# Altium project RiscPC_VRAM_16bit.PrjPcb
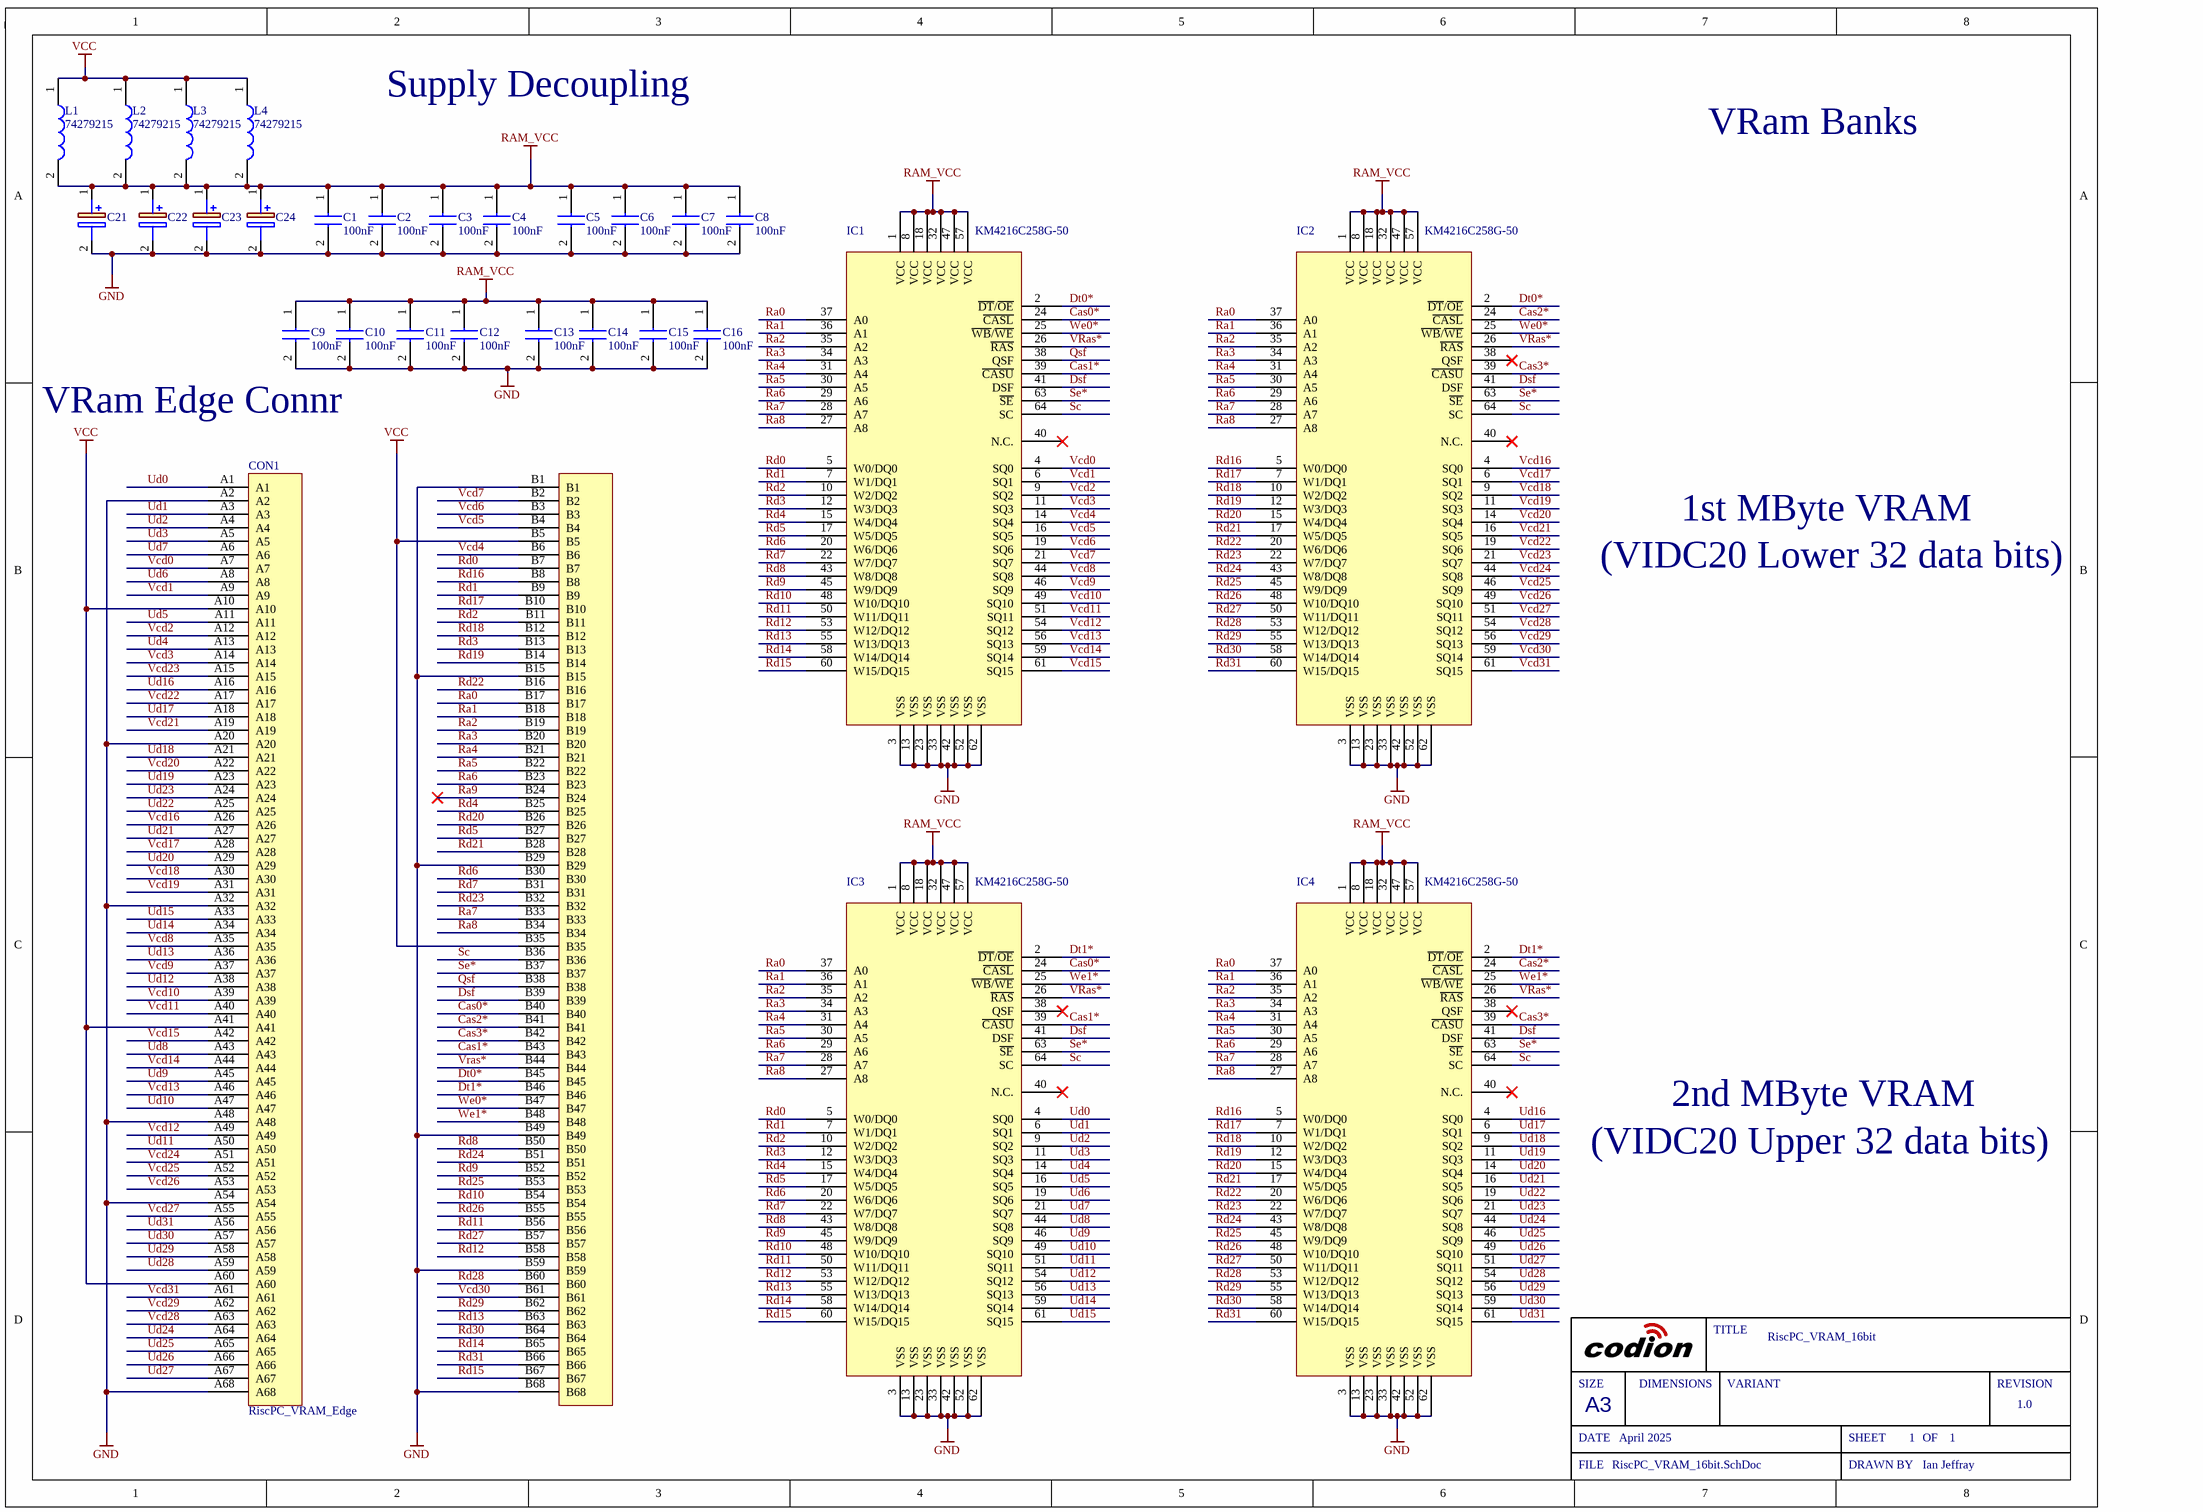
[diagram p0: RiscPC_VRAM_16bit.SchDoc]
Sch_RevNo: 1.0; Sch_ReleaseDate: April 2025; Project_Title: RiscPC_VRAM_16bit; DrawnBy: Ian Jeffray
1 sheet, 29 parts. Net scope: global (net labels, ports and power ports of the same name join across sheets).
Board file: RiscPC_VRAM_16bit.PcbDoc

## Sheet RiscPC_VRAM_16bit.SchDoc
size A3; SheetNumber: 1; SheetTotal: 1

### Parts
C1  100nF  [CAPC2012X145N]
C2  100nF  [CAPC2012X145N]
C3  100nF  [CAPC2012X145N]
C4  100nF  [CAPC2012X145N]
C5  100nF  [CAPC2012X145N]
C6  100nF  [CAPC2012X145N]
C7  100nF  [CAPC2012X145N]
C8  100nF  [CAPC2012X145N]
C9  100nF  [CAPC2012X145N]
C10  100nF  [CAPC2012X145N]
C11  100nF  [CAPC2012X145N]
C12  100nF  [CAPC2012X145N]
C13  100nF  [CAPC2012X145N]
C14  100nF  [CAPC2012X145N]
C15  100nF  [CAPC2012X145N]
C16  100nF  [CAPC2012X145N]
C21  EEE-HA1C470AP  [EEE1AA101SP]  (value not drawn)
C22  EEE-HA1C470AP  [EEE1AA101SP]  (value not drawn)
C23  EEE-HA1C470AP  [EEE1AA101SP]  (value not drawn)
C24  EEE-HA1C470AP  [EEE1AA101SP]  (value not drawn)
CON1  RiscPC_VRAM_Edge  [RiscPC_VRAM_Edge]
IC1  KM4216C258G-50  [KM4216C258G-50_SSOP64]
IC2  KM4216C258G-50  [KM4216C258G-50_SSOP64]
IC3  KM4216C258G-50  [KM4216C258G-50_SSOP64]
IC4  KM4216C258G-50  [KM4216C258G-50_SSOP64]
L1  74279215  [INDC3216X130N]
L2  74279215  [INDC3216X130N]
L3  74279215  [INDC3216X130N]
L4  74279215  [INDC3216X130N]

### Nets
GND: C1.2 C2.2 C3.2 C4.2 C5.2 C6.2 C7.2 C8.2 C9.2 C10.2 C11.2 C12.2 C13.2 C14.2 C15.2 C16.2 C21.2(-) C22.2(-) C23.2(-) C24.2(-) CON1.A2 CON1.A20 CON1.A32 CON1.A48 CON1.A54 CON1.A68 CON1.B1 CON1.B15 CON1.B29 CON1.B49 CON1.B59 CON1.B68 IC1.3(VSS) IC1.13(VSS) IC1.23(VSS) IC1.33(VSS) IC1.42(VSS) IC1.52(VSS) IC1.62(VSS) IC2.3(VSS) IC2.13(VSS) IC2.23(VSS) IC2.33(VSS) IC2.42(VSS) IC2.52(VSS) IC2.62(VSS) IC3.3(VSS) IC3.13(VSS) IC3.23(VSS) IC3.33(VSS) IC3.42(VSS) IC3.52(VSS) IC3.62(VSS) IC4.3(VSS) IC4.13(VSS) IC4.23(VSS) IC4.33(VSS) IC4.42(VSS) IC4.52(VSS) IC4.62(VSS)
RAM_VCC: C1.1 C2.1 C3.1 C4.1 C5.1 C6.1 C7.1 C8.1 C9.1 C10.1 C11.1 C12.1 C13.1 C14.1 C15.1 C16.1 C21.1(+) C22.1(+) C23.1(+) C24.1(+) IC1.1(VCC) IC1.8(VCC) IC1.18(VCC) IC1.32(VCC) IC1.47(VCC) IC1.57(VCC) IC2.1(VCC) IC2.8(VCC) IC2.18(VCC) IC2.32(VCC) IC2.47(VCC) IC2.57(VCC) IC3.1(VCC) IC3.8(VCC) IC3.18(VCC) IC3.32(VCC) IC3.47(VCC) IC3.57(VCC) IC4.1(VCC) IC4.8(VCC) IC4.18(VCC) IC4.32(VCC) IC4.47(VCC) IC4.57(VCC) L1.2 L2.2 L3.2 L4.2
VCC: CON1.A10 CON1.A41 CON1.A60 CON1.B5 CON1.B35 L1.1 L2.1 L3.1 L4.1
Cas0*: CON1.B40 IC1.24(~{CASL}) IC3.24(~{CASL})
Cas1*: CON1.B43 IC1.39(~{CASU}) IC3.39(~{CASU})
Cas2*: CON1.B41 IC2.24(~{CASL}) IC4.24(~{CASL})
Cas3*: CON1.B42 IC2.39(~{CASU}) IC4.39(~{CASU})
Dsf: CON1.B39 IC1.41(DSF) IC2.41(DSF) IC3.41(DSF) IC4.41(DSF)
Dt0*: CON1.B45 IC1.2(~{DT}/~{OE}) IC2.2(~{DT}/~{OE})
Dt1*: CON1.B46 IC3.2(~{DT}/~{OE}) IC4.2(~{DT}/~{OE})
Qsf: CON1.B38 IC1.38(QSF)
Ra0: CON1.B17 IC1.37(A0) IC2.37(A0) IC3.37(A0) IC4.37(A0)
Ra1: CON1.B18 IC1.36(A1) IC2.36(A1) IC3.36(A1) IC4.36(A1)
Ra2: CON1.B19 IC1.35(A2) IC2.35(A2) IC3.35(A2) IC4.35(A2)
Ra3: CON1.B20 IC1.34(A3) IC2.34(A3) IC3.34(A3) IC4.34(A3)
Ra4: CON1.B21 IC1.31(A4) IC2.31(A4) IC3.31(A4) IC4.31(A4)
Ra5: CON1.B22 IC1.30(A5) IC2.30(A5) IC3.30(A5) IC4.30(A5)
Ra6: CON1.B23 IC1.29(A6) IC2.29(A6) IC3.29(A6) IC4.29(A6)
Ra7: CON1.B33 IC1.28(A7) IC2.28(A7) IC3.28(A7) IC4.28(A7)
Ra8: CON1.B34 IC1.27(A8) IC2.27(A8) IC3.27(A8) IC4.27(A8)
Ra9: CON1.B24
Rd0: CON1.B7 IC1.5(W0/DQ0) IC3.5(W0/DQ0)
Rd1: CON1.B9 IC1.7(W1/DQ1) IC3.7(W1/DQ1)
Rd2: CON1.B11 IC1.10(W2/DQ2) IC3.10(W2/DQ2)
Rd3: CON1.B13 IC1.12(W3/DQ3) IC3.12(W3/DQ3)
Rd4: CON1.B25 IC1.15(W4/DQ4) IC3.15(W4/DQ4)
Rd5: CON1.B27 IC1.17(W5/DQ5) IC3.17(W5/DQ5)
Rd6: CON1.B30 IC1.20(W6/DQ6) IC3.20(W6/DQ6)
Rd7: CON1.B31 IC1.22(W7/DQ7) IC3.22(W7/DQ7)
Rd8: CON1.B50 IC1.43(W8/DQ8) IC3.43(W8/DQ8)
Rd9: CON1.B52 IC1.45(W9/DQ9) IC3.45(W9/DQ9)
Rd10: CON1.B54 IC1.48(W10/DQ10) IC3.48(W10/DQ10)
Rd11: CON1.B56 IC1.50(W11/DQ11) IC3.50(W11/DQ11)
Rd12: CON1.B58 IC1.53(W12/DQ12) IC3.53(W12/DQ12)
Rd13: CON1.B63 IC1.55(W13/DQ13) IC3.55(W13/DQ13)
Rd14: CON1.B65 IC1.58(W14/DQ14) IC3.58(W14/DQ14)
Rd15: CON1.B67 IC1.60(W15/DQ15) IC3.60(W15/DQ15)
Rd16: CON1.B8 IC2.5(W0/DQ0) IC4.5(W0/DQ0)
Rd17: CON1.B10 IC2.7(W1/DQ1) IC4.7(W1/DQ1)
Rd18: CON1.B12 IC2.10(W2/DQ2) IC4.10(W2/DQ2)
Rd19: CON1.B14 IC2.12(W3/DQ3) IC4.12(W3/DQ3)
Rd20: CON1.B26 IC2.15(W4/DQ4) IC4.15(W4/DQ4)
Rd21: CON1.B28 IC2.17(W5/DQ5) IC4.17(W5/DQ5)
Rd22: CON1.B16 IC2.20(W6/DQ6) IC4.20(W6/DQ6)
Rd23: CON1.B32 IC2.22(W7/DQ7) IC4.22(W7/DQ7)
Rd24: CON1.B51 IC2.43(W8/DQ8) IC4.43(W8/DQ8)
Rd25: CON1.B53 IC2.45(W9/DQ9) IC4.45(W9/DQ9)
Rd26: CON1.B55 IC2.48(W10/DQ10) IC4.48(W10/DQ10)
Rd27: CON1.B57 IC2.50(W11/DQ11) IC4.50(W11/DQ11)
Rd28: CON1.B60 IC2.53(W12/DQ12) IC4.53(W12/DQ12)
Rd29: CON1.B62 IC2.55(W13/DQ13) IC4.55(W13/DQ13)
Rd30: CON1.B64 IC2.58(W14/DQ14) IC4.58(W14/DQ14)
Rd31: CON1.B66 IC2.60(W15/DQ15) IC4.60(W15/DQ15)
Sc: CON1.B36 IC1.64(SC) IC2.64(SC) IC3.64(SC) IC4.64(SC)
Se*: CON1.B37 IC1.63(~{SE}) IC2.63(~{SE}) IC3.63(~{SE}) IC4.63(~{SE})
Ud0: CON1.A1 IC3.4(SQ0)
Ud1: CON1.A3 IC3.6(SQ1)
Ud2: CON1.A4 IC3.9(SQ2)
Ud3: CON1.A5 IC3.11(SQ3)
Ud4: CON1.A13 IC3.14(SQ4)
Ud5: CON1.A11 IC3.16(SQ5)
Ud6: CON1.A8 IC3.19(SQ6)
Ud7: CON1.A6 IC3.21(SQ7)
Ud8: CON1.A43 IC3.44(SQ8)
Ud9: CON1.A45 IC3.46(SQ9)
Ud10: CON1.A47 IC3.49(SQ10)
Ud11: CON1.A50 IC3.51(SQ11)
Ud12: CON1.A38 IC3.54(SQ12)
Ud13: CON1.A36 IC3.56(SQ13)
Ud14: CON1.A34 IC3.59(SQ14)
Ud15: CON1.A33 IC3.61(SQ15)
Ud16: CON1.A16 IC4.4(SQ0)
Ud17: CON1.A18 IC4.6(SQ1)
Ud18: CON1.A21 IC4.9(SQ2)
Ud19: CON1.A23 IC4.11(SQ3)
Ud20: CON1.A29 IC4.14(SQ4)
Ud21: CON1.A27 IC4.16(SQ5)
Ud22: CON1.A25 IC4.19(SQ6)
Ud23: CON1.A24 IC4.21(SQ7)
Ud24: CON1.A64 IC4.44(SQ8)
Ud25: CON1.A65 IC4.46(SQ9)
Ud26: CON1.A66 IC4.49(SQ10)
Ud27: CON1.A67 IC4.51(SQ11)
Ud28: CON1.A59 IC4.54(SQ12)
Ud29: CON1.A58 IC4.56(SQ13)
Ud30: CON1.A57 IC4.59(SQ14)
Ud31: CON1.A56 IC4.61(SQ15)
Vcd0: CON1.A7 IC1.4(SQ0)
Vcd1: CON1.A9 IC1.6(SQ1)
Vcd2: CON1.A12 IC1.9(SQ2)
Vcd3: CON1.A14 IC1.11(SQ3)
Vcd4: CON1.B6 IC1.14(SQ4)
Vcd5: CON1.B4 IC1.16(SQ5)
Vcd6: CON1.B3 IC1.19(SQ6)
Vcd7: CON1.B2 IC1.21(SQ7)
Vcd8: CON1.A35 IC1.44(SQ8)
Vcd9: CON1.A37 IC1.46(SQ9)
Vcd10: CON1.A39 IC1.49(SQ10)
Vcd11: CON1.A40 IC1.51(SQ11)
Vcd12: CON1.A49 IC1.54(SQ12)
Vcd13: CON1.A46 IC1.56(SQ13)
Vcd14: CON1.A44 IC1.59(SQ14)
Vcd15: CON1.A42 IC1.61(SQ15)
Vcd16: CON1.A26 IC2.4(SQ0)
Vcd17: CON1.A28 IC2.6(SQ1)
Vcd18: CON1.A30 IC2.9(SQ2)
Vcd19: CON1.A31 IC2.11(SQ3)
Vcd20: CON1.A22 IC2.14(SQ4)
Vcd21: CON1.A19 IC2.16(SQ5)
Vcd22: CON1.A17 IC2.19(SQ6)
Vcd23: CON1.A15 IC2.21(SQ7)
Vcd24: CON1.A51 IC2.44(SQ8)
Vcd25: CON1.A52 IC2.46(SQ9)
Vcd26: CON1.A53 IC2.49(SQ10)
Vcd27: CON1.A55 IC2.51(SQ11)
Vcd28: CON1.A63 IC2.54(SQ12)
Vcd29: CON1.A62 IC2.56(SQ13)
Vcd30: CON1.B61 IC2.59(SQ14)
Vcd31: CON1.A61 IC2.61(SQ15)
Vras*: CON1.B44 IC1.26(~{RAS}) IC2.26(~{RAS}) IC3.26(~{RAS}) IC4.26(~{RAS})
We0*: CON1.B47 IC1.25(~{WB}/~{WE}) IC2.25(~{WB}/~{WE})
We1*: CON1.B48 IC3.25(~{WB}/~{WE}) IC4.25(~{WB}/~{WE})

Not connected (* = marked no-connect by the designer): IC1 40(N.C.)*; IC2 38(QSF)* 40(N.C.)*; IC3 38(QSF)* 40(N.C.)*; IC4 38(QSF)* 40(N.C.)*

### Notes on the sheet
- Supply Decoupling
- VRam Banks
- VRam Edge Connr
- (VIDC20 Lower 32 data bits)
- 1st MByte VRAM
- 2nd MByte VRAM
- (VIDC20 Upper 32 data bits)
- SIZE
- DIMENSIONS
- TITLE
- VARIANT
- REVISION
- DATE
- A3
- SHEET
- OF
- FILE
- DRAWN BY

### Library data of the parts
C1-C16 = C2012X7R1H104K125AM: Capacitor; Manufacturer_Name: TDK; Datasheet Link: https://product.tdk.com/info/en/catalog/datasheets/mlcc_commercial_midvoltage_en.pdf; Height: 1.45mm; Manufacturer_Part_Number: C2012X7R1H104K125AM; Mouser Part Number: 810-C2012X7R1H104KT5; Mouser Price/Stock: https://www.mouser.com/Search/Refine.aspx?Keyword=810-C2012X7R1H104KT5; Arrow Part Number: C2012X7R1H104K125AM; Arrow Price/Stock: https://www.arrow.com/en/products/c2012x7r1h104k125am/tdk
C21-C24 = EEE-HA1C470AP: Capacitor Polarised; Manufacturer_Name: Panasonic; Datasheet Link: http://industrial.panasonic.com/cdbs/www-data/pdf/RDE0000/ABA0000C1148.pdf; Height: 7.8mm; Manufacturer_Part_Number: EEE-HA1C470AP; Mouser Part Number: 667-EEE-HA1C470AP; Mouser Price/Stock: https://www.mouser.co.uk/ProductDetail/Panasonic/EEE-HA1C470AP?qs=d1CqaRUMZD%2FL5qU1hDRerg%3D%3D; Arrow Part Number: EEE-HA1C470AP; Arrow Price/Stock: https://www.arrow.com/en/products/eeeha1c470ap/panasonic?utm_currency=USD&region=europe
L1-L4 = 74279215: Inductor; Manufacturer_Name: Wurth Elektronik; Datasheet Link: http://componentsearchengine.com/Datasheets/1/74279215.pdf; Height: 1.3mm; Manufacturer_Part_Number: 74279215; Mouser Part Number: 710-74279215; Mouser Price/Stock: https://www.mouser.co.uk/ProductDetail/Wurth-Elektronik/74279215?qs=5twSNpOB8IC%252BebnV0jQtuw%3D%3D